# Altium schematic sheet ADS1158.SchDoc
size A4
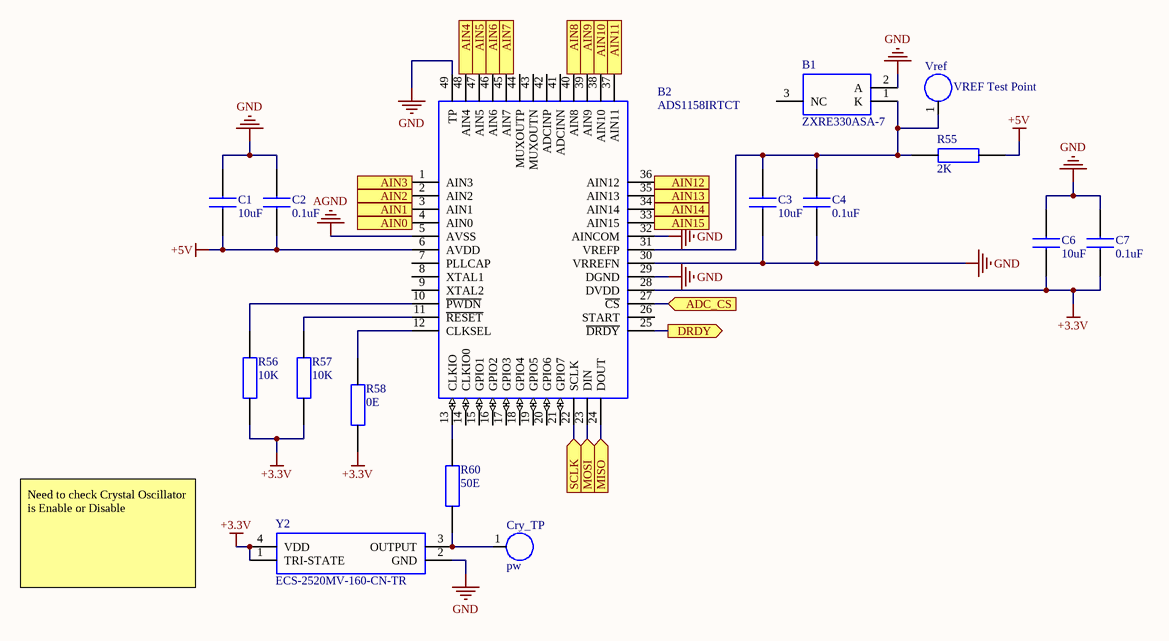
[diagram p0: ADS1158.SchDoc]

## Parts
B1  ZXRE330ASA-7  [SOT96P240X110-3N]
B2  ADS1158IRTCT  [QFN-48]
C1  10uF  [CAPC1608X80N]
C2  0.1uF  [CAPC1005X55N]
C3  10uF  [CAPC1608X80N]
C4  0.1uF  [CAPC1005X55N]
C6  10uF  [CAPC1608X80N]
C7  0.1uF  [CAPC1005X55N]
Cry_TP  pw  [Test Points]
R55  2K  [RESC1005X40N]
R56  10K  [RESC1005X40N]
R57  10K  [RESC1005X40N]
R58  0E  [RESC1005X40N]
R60  50E  [RESC1005X35N]
Vref  VREF Test Point  [Test Points]
Y2  ECS-2520MV-160-CN-TR  [ECS2520MV250BNTR]

## Ports
ADC_CS (in), AIN0 (in), AIN1 (in), AIN2 (in), AIN3 (in), AIN4 (in), AIN5 (in), AIN6 (in), AIN7 (in), AIN8 (in), AIN9 (in), AIN10 (in), AIN11 (in), AIN12 (in), AIN13 (in), AIN14 (in), AIN15 (in), DRDY (out), MISO (in), MOSI (in), SCLK (in)

## Nets
+3.3V: B2.28(DVDD) C6.1 C7.1 R56.1 R57.1 R58.1 Y2.1(TRI-STATE) Y2.4(VDD)
+5V: B2.6(AVDD) C1.1 C2.1 R55.2
AGND: B2.5(AVSS)
GND: B1.2(A) B2.29(DGND) B2.30(VRREFN) B2.32(AINCOM) B2.49(TP) C1.2 C2.2 C3.1 C4.1 C6.2 C7.2 Y2.2(GND)
ADC_CS: B2.27(~{CS}) ; port ADC_CS
AIN0: B2.4(AIN0) ; port AIN0
AIN1: B2.3(AIN1) ; port AIN1
AIN2: B2.2(AIN2) ; port AIN2
AIN3: B2.1(AIN3) ; port AIN3
AIN4: B2.48(AIN4) ; port AIN4
AIN5: B2.47(AIN5) ; port AIN5
AIN6: B2.46(AIN6) ; port AIN6
AIN7: B2.45(AIN7) ; port AIN7
AIN8: B2.40(AIN8) ; port AIN8
AIN9: B2.39(AIN9) ; port AIN9
AIN10: B2.38(AIN10) ; port AIN10
AIN11: B2.37(AIN11) ; port AIN11
AIN12: B2.36(AIN12) ; port AIN12
AIN13: B2.35(AIN13) ; port AIN13
AIN14: B2.34(AIN14) ; port AIN14
AIN15: B2.33(AIN15) ; port AIN15
DRDY: B2.25(~{DRDY}) ; port DRDY
MISO: B2.24(DOUT) ; port MISO
MOSI: B2.23(DIN) ; port MOSI
SCLK: B2.22(SCLK) ; port SCLK
NetB1_1: B1.1(K) B2.31(VREFP) C3.2 C4.2 R55.1 Vref.1
NetB2_10: B2.10(~{PWDN}) R56.2
NetB2_11: B2.11(~{RESET}) R57.2
NetB2_12: B2.12(CLKSEL) R58.2
NetB2_13: B2.13(CLKIO) R60.2
NetCry_TP_1: Cry_TP.1 R60.1 Y2.3(OUTPUT)

Not connected (* = marked no-connect by the designer): B1 3(NC); B2 7(PLLCAP) 8(XTAL1) 9(XTAL2) 14(CLKIO0) 15(GPIO1) 16(GPIO2) 17(GPIO3) 18(GPIO4) 19(GPIO5) 20(GPIO6) 21(GPIO7) 26(START) 41(ADCINN) 42(ADCINP) 43(MUXOUTN) 44(MUXOUTP)

## Notes on the sheet
- Need to check Crystal Oscillator is Enable or Disable

## Library data of the parts
B1 = ZXRE330ASA-7: Diodes Inc ZXRE330ASA-7, Shunt Precision Voltage Reference 3.3V, +/-0.5%, 3-Pin SOT-23; Manufacturer_Name: Diodes Inc.; Geometry.Height: 1.1mm; Manufacturer_Part_Number: ZXRE330ASA-7; Arrow Part Number: ZXRE330ASA-7; Arrow Price/Stock: https://www.arrow.com/en/products/zxre330asa-7/diodes-incorporated; Mouser Part Number: 621-ZXRE330ASA-7; Mouser Price/Stock: https://www.mouser.co.uk/ProductDetail/Diodes-Incorporated/ZXRE330ASA-7?qs=4q%2FTN4Rqj6JkCriwoAvbDA%3D%3D; Datasheet Link: https://www.diodes.com/assets/Datasheets/ZXRE330.pdf
B2 = ADS1158IRTCT: 16-Bit, 125kSPS, 16-Ch Delta-Sigma ADC w/ Fast Channel Scan & Automatic Sequencer; Manufacturer_Name: Texas Instruments; Geometry.Height: 0.9mm; Manufacturer_Part_Number: ADS1158IRTCT; Arrow Part Number: ADS1158IRTCT; Arrow Price/Stock: https://www.arrow.com/en/products/ads1158irtct/texas-instruments; Mouser Part Number: 595-ADS1158IRTCT; Mouser Price/Stock: https://www.mouser.co.uk/ProductDetail/Texas-Instruments/ADS1158IRTCT?qs=Fn3VdHBzkcmocHRSn4DsYg%3D%3D; Datasheet Link: http://www.mouser.com/ds/2/405/ads1158-404657.pdf
C1 C3 C6 = C1608X5R1A106K080AC: TDK - C1608X5R1A106K080AC - CAP, MLCC, X5R, 10UF, 10V, 0603; Geometry.Height: 0.8mm; Manufacturer_Name: TDK; Manufacturer_Part_Number: C1608X5R1A106K080AC; Arrow Part Number: C1608X5R1A106K080AC; Arrow Price/Stock: https://www.arrow.com/en/products/c1608x5r1a106k080ac/tdk; Mouser Part Number: 810-C1608X5R1A106K; Mouser Price/Stock: https://www.mouser.co.uk/ProductDetail/TDK/C1608X5R1A106K080AC?qs=NRhsANhppD%252B2Bx3rv7OLbA%3D%3D; Datasheet Link: https://product.tdk.com/info/en/catalog/datasheets/mlcc_commercial_midvoltage_en.pdf
C2 C4 C7 = C0402C104M4RECTU: Multilayer Ceramic Capacitors MLCC - SMD/SMT 16V 0.1uF X7R 0402 20%; Manufacturer_Name: Kemet; Geometry.Height: 0.55mm; Manufacturer_Part_Number: C0402C104M4RECTU; Arrow Part Number: C0402C104M4RECTU; Arrow Price/Stock: *; Mouser Part Number: 80-C0402C104M4RECTU; Mouser Price/Stock: https://www.mouser.com/Search/Refine.aspx?Keyword=80-C0402C104M4RECTU; Datasheet Link: https://content.kemet.com/datasheets/KEM_C1002_X7R_SMD.pdf
Cry_TP Vref = Test Points
R55 = RC0402JR-072KL: RESISTOR, 0402 2K Ohms +/-5% 1/16 W; Manufacturer_Name: YAGEO (PHYCOMP); Geometry.Height: 0.4mm; Manufacturer_Part_Number: RC0402JR-072KL; Arrow Part Number: RC0402JR-072KL; Arrow Price/Stock: https://www.arrow.com/en/products/rc0402jr-072kl/yageo; Mouser Part Number: 603-RC0402JR-072KL; Mouser Price/Stock: https://www.mouser.com/Search/Refine.aspx?Keyword=603-RC0402JR-072KL; Datasheet Link: http://www.yageo.com/documents/recent/PYu-RC0402_51_RoHS_L_6_r.pdf
R56 R57 = CRCW040210K0FKED: CRCW0402 Resistor T/R 0.063W,1%,10K Vishay CRCW Series Thick Film Surface Mount Resistor 0402 Case 10k +/-1% 0.063W +/-100ppm/C; Geometry.Height: 0.4mm; Manufacturer_Name: Vishay; Manufacturer_Part_Number: CRCW040210K0FKED; Arrow Part Number: CRCW040210K0FKED; Arrow Price/Stock: https://www.arrow.com/en/products/crcw040210k0fked/vishay; Mouser Part Number: 71-CRCW0402-10K-E3; Mouser Price/Stock: https://www.mouser.co.uk/ProductDetail/Vishay-Dale/CRCW040210K0FKED?qs=rlE3Te1NifyN3e8vvxacSw%3D%3D; Datasheet Link: http://www.vishay.com/docs/20035/dcrcwe3.pdf
R58 = RC0402FR-070RL: Thick Film Resistors - SMD 0.0ohm 1%; Manufacturer_Name: YAGEO (PHYCOMP); Geometry.Height: 0.4mm; Manufacturer_Part_Number: RC0402FR-070RL; Arrow Part Number: RC0402FR-070RL; Arrow Price/Stock: https://www.arrow.com/en/products/rc0402fr-070rl/yageo; Mouser Part Number: 603-RC0402FR-070RL; Mouser Price/Stock: https://www.mouser.co.uk/ProductDetail/Yageo/RC0402FR-070RL?qs=sxZXDnvRBEhfSy4CZGX2ww%3D%3D; Datasheet Link: http://www.yageo.com/documents/recent/PYu-RC0402_51_RoHS_L_6_r.pdf
R60 = RT0402BRE0750RL: Thin Film Resistors - SMD 50 ohm 0.1% 50 ppm High-Precision; Manufacturer_Name: YAGEO (PHYCOMP); Geometry.Height: 0.35mm; Manufacturer_Part_Number: RT0402BRE0750RL; Arrow Part Number: RT0402BRE0750RL; Arrow Price/Stock: *; Mouser Part Number: 603-RT0402BRE0750RL; Mouser Price/Stock: https://www.mouser.com/Search/Refine.aspx?Keyword=603-RT0402BRE0750RL; Datasheet Link: https://componentsearchengine.com/Datasheets/1/RT0402BRE0750RL.pdf
Y2 = ECS-2520MV-160-CN-TR: Standard Clock Oscillators 16MHz 1.6-3.6 V 25ppm -40C +85C; Manufacturer_Name: ECS; Manufacturer_Part_Number: ECS-2520MV-160-CN-TR; Arrow Part Number: ECS-2520MV-160-CN-TR; Arrow Price/Stock: *; Mouser Part Number: 520-2520MV-160-CNT; Mouser Price/Stock: https://www.mouser.co.uk/ProductDetail/ECS/ECS-2520MV-160-CN-TR?qs=byeeYqUIh0MIhToPrW09tg%3D%3D; Datasheet Link: https://www.ecsxtal.com/store/pdf/ECS-2520MV.pdf